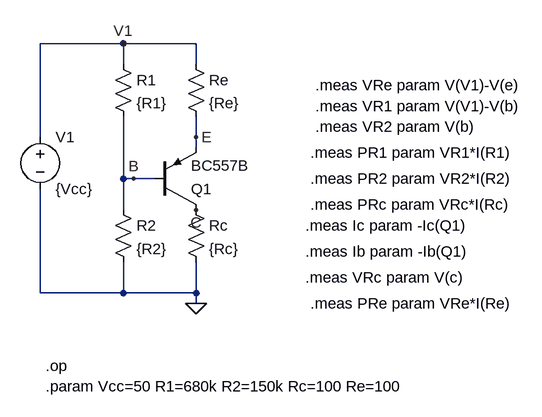
[diagram p0: schematic TBJ06a.asc]
TBJ06a.asc, the LTspice schematic file:
Version 4
SHEET 1 984 680
WIRE 256 -32 128 -32
WIRE 368 -32 256 -32
WIRE 256 0 256 -32
WIRE 368 0 368 -32
WIRE 128 112 128 -32
WIRE 368 112 368 80
WIRE 368 128 368 112
WIRE 256 176 256 80
WIRE 272 176 256 176
WIRE 304 176 272 176
WIRE 256 224 256 176
WIRE 128 352 128 192
WIRE 256 352 256 304
WIRE 256 352 128 352
WIRE 368 352 368 304
WIRE 368 352 256 352
WIRE 368 368 368 352
FLAG 368 368 0
FLAG 272 176 B
FLAG 256 -32 V1
FLAG 368 112 E
FLAG 368 224 C
SYMBOL voltage 128 96 R0
WINDOW 123 0 0 Left 0
WINDOW 39 0 0 Left 0
SYMATTR InstName V1
SYMATTR Value {Vcc}
SYMBOL res 240 -16 R0
SYMATTR InstName R1
SYMATTR Value {R1}
SYMBOL res 352 208 R0
SYMATTR InstName Rc
SYMATTR Value {Rc}
SYMBOL res 352 -16 R0
SYMATTR InstName Re
SYMATTR Value {Re}
SYMBOL res 240 208 R0
SYMATTR InstName R2
SYMATTR Value {R2}
SYMBOL pnp 304 224 M180
SYMATTR InstName Q1
SYMATTR Value BC557B
TEXT 136 464 Left 2 !.op
TEXT 136 496 Left 2 !.param Vcc=50 R1=680k R2=150k Rc=100 Re=100
TEXT 552 32 Left 2 !.meas VRe param V(V1)-V(e)
TEXT 552 64 Left 2 !.meas VR1 param V(V1)-V(b)
TEXT 544 176 Left 2 !.meas PR2 param VR2*I(R2)
TEXT 544 216 Left 2 !.meas PRc param VRc*I(Rc)
TEXT 536 328 Left 2 !.meas VRc param V(c)
TEXT 544 368 Left 2 !.meas PRe param VRe*I(Re)
TEXT 552 96 Left 2 !.meas VR2 param V(b)
TEXT 544 136 Left 2 !.meas PR1 param VR1*I(R1)
TEXT 536 248 Left 2 !.meas Ic param -Ic(Q1)
TEXT 536 288 Left 2 !.meas Ib param -Ib(Q1)

The netlist it stands for:
* TBJ06a.asc
V1 V1 0 {Vcc}
R1 V1 B {R1}
Rc C 0 {Rc}
Re V1 E {Re}
R2 B 0 {R2}
Q1 C B E 0 BC557B
.model NPN NPN
.model PNP PNP
.lib standard.bjt
.op
.param Vcc=50 R1=680k R2=150k Rc=100 Re=100
.meas VRe param V(V1)-V(e)
.meas VR1 param V(V1)-V(b)
.meas PR2 param VR2*I(R2)
.meas PRc param VRc*I(Rc)
.meas VRc param V(c)
.meas PRe param VRe*I(Re)
.meas VR2 param V(b)
.meas PR1 param VR1*I(R1)
.meas Ic param -Ic(Q1)
.meas Ib param -Ib(Q1)
.backanno
.end